# EAGLE schematic uart-usb (EAGLE 6.1)
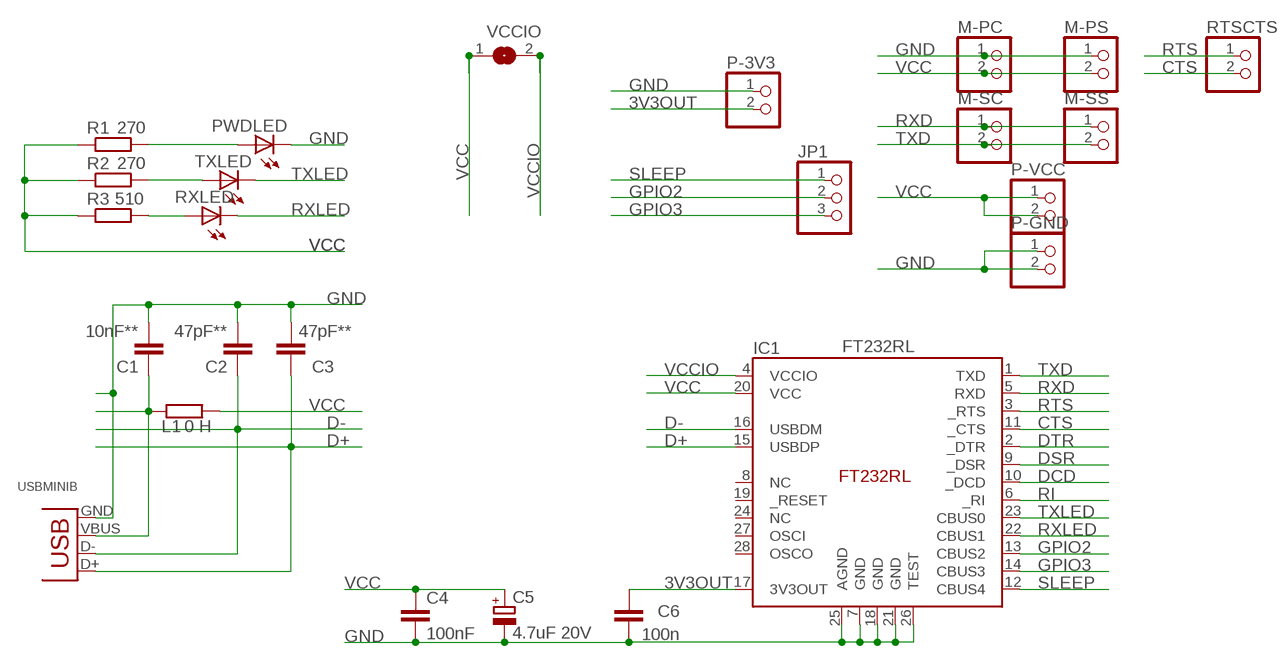
[diagram p0: schematic, sheet 1]

## Parts
C1  10nF**  C-EUC0805K  [C0805K]
C2  47pF**  C-EUC0805K  [C0805K]
C3  47pF**  C-EUC0805K  [C0805K]
C4  100nF  C-EUC0805K  [C0805K]
C5  4.7uF 20V  CPOL-EUSMCA  [SMC_A]
C6  100n  C-EUC0805K  [C0805K]
IC1  FT232RL  [SSOP-28]
JP1  PINHD-1X3  [1X03]
L1  0 H  R-EU_R0805  [R0805]
M-PC  PINHD-1X2/90  [1X02/90]
M-PS  PINHD-1X2  [1X02]
M-SC  PINHD-1X2/90  [1X02/90]
M-SS  PINHD-1X2  [1X02]
P-3V3  PINHD-1X2  [1X02]
P-GND  PINHD-1X2  [1X02]
P-VCC  PINHD-1X2  [1X02]
PWDLED  LEDCHIPLED_0805  [CHIPLED_0805]
R1  270  R-EU_R0805  [R0805]
R2  270  R-EU_R0805  [R0805]
R3  510  R-EU_R0805  [R0805]
RTSCTS  PINHD-1X2  [1X02]
RXLED  LEDCHIPLED_0805  [CHIPLED_0805]
TXLED  LEDCHIPLED_0805  [CHIPLED_0805]
USBMINIB  USB-MB-S  [USB-MB-S]
VCCIO  SJ  [SJ]

## Nets
3V3OUT [GPIO]: C6.1 IC1.17(3V3OUT) P-3V3.2
CTS [NORMAL]: IC1.11(_CTS) RTSCTS.2
D+: C3.1 IC1.15(USBDP) USBMINIB.D+
D-: C2.1 IC1.16(USBDM) USBMINIB.D-
DCD [NORMAL]: IC1.10(_DCD)
DSR [NORMAL]: IC1.9(_DSR)
DTR [NORMAL]: IC1.2(_DTR)
GND: C1.2 C2.2 C3.2 C4.2 C5.- C6.2 IC1.7(GND) IC1.18(GND) IC1.21(GND) IC1.25(AGND) IC1.26(TEST) M-PC.1 M-PS.1 P-3V3.1 P-GND.1 P-GND.2 PWDLED.C USBMINIB.GND
GPIO2 [GPIO]: IC1.13(CBUS2) JP1.2
GPIO3 [GPIO]: IC1.14(CBUS3) JP1.3
N$1: R3.2 RXLED.A
N$2: PWDLED.A R1.2
N$3: R2.2 TXLED.A
N$4: C1.1 L1.1 USBMINIB.VBUS
RI [NORMAL]: IC1.6(_RI)
RTS [NORMAL]: IC1.3(_RTS) RTSCTS.1
RXD [NORMAL]: IC1.5(RXD) M-SC.1 M-SS.1
RXLED [GPIO]: IC1.22(CBUS1) RXLED.C
SLEEP [GPIO]: IC1.12(CBUS4) JP1.1
TXD [NORMAL]: IC1.1(TXD) M-SC.2 M-SS.2
TXLED [GPIO]: IC1.23(CBUS0) TXLED.C
VCC: C4.1 C5.+ IC1.20(VCC) L1.2 M-PC.2 M-PS.2 P-VCC.1 P-VCC.2 R1.1 R2.1 R3.1 VCCIO.1
VCCIO: IC1.4(VCCIO) VCCIO.2
Unconnected: IC1.8(NC) IC1.19(_RESET) IC1.24(NC) IC1.27(OSCI) IC1.28(OSCO)

## Library data of the parts
C1-C4 C6 = resistor:C-EU: CAPACITOR, European symbol
C5 = resistor:CPOL-EU: POLARIZED CAPACITOR, European symbol
IC1 = ftdi4:FT232RL
JP1 = pinhead:PINHD-1X3: PIN HEADER
L1 R1-R3 = resistor:R-EU_: RESISTOR, European symbol
M-PC M-PS M-SC M-SS P-3V3 P-GND P-VCC RTSCTS = pinhead:PINHD-1X2: PIN HEADER
PWDLED RXLED TXLED = led:LED: LED OSRAM: - CHIPLED LG R971, LG N971, LY N971, LG Q971, LY Q971, LO R971, LY R971 LH N974, LH R974 LS Q976, LO Q976, LY Q976 LO Q996 - Hyper CHIPLED LW Q18S LB Q993, LB Q99A, LB R99A - SideLED LS A670, LO A670, LY A670, LG A670, LP A670 LB A673, LV A673, LT A673, LW A673 LH A674 LY A675 LS A676, LA A676, LO A676, LY A676, LW A676 LS A679, LY A679, LG A679 - Hyper Micro SIDELED® LS Y876, LA Y876, LO Y876, LY Y876 LT Y87S - SmartLED LW L88C, LW L88S LB L89C, LB L89S, LG L890 LS L89K, LO L89K, LY L89K LS L896, LA L896, LO L896, LY L896 - TOPLED LS T670, LO T670, LY T670, LG T670, LP T670 LSG T670, LSP T670, LSY T670, LOP T670, LYG T670 LG T671, LOG T671, LSG T671 LB T673, LV T673, LT T673, LW T673 LH T674 LS T676, LA T676, LO T676, LY T676, LB T676, LH T676, LSB T676, LW T676 LB T67C, LV T67C, LT T67C, LS T67K, LO T67K, LY T67K, LW E67C LS E67B, LA E67B, LO E67B, LY E67B, LB E67C, LV E67C, LT E67C LW T67C LS T679, LY T679, LG T679 LS T770, LO T770, LY T770, LG T770, LP T770 LB T773, LV T773, LT T773, LW T773 LH T774 LS E675, LA E675, LY E675, LS T675 LS T776, LA T776, LO T776, LY T776, LB T776 LHGB T686 LT T68C, LB T68C - Hyper Mini TOPLED® LB M676 - Mini TOPLED Santana® LG M470 LS M47K, LO M47K, LY M47K Source: http://www.osram.convergy.de LUXEON: - LUMILED® LXK2-PW12-R00, LXK2-PW12-S00, LXK2-PW14-U00, LXK2-PW14-V00 LXK2-PM12-R00, LXK2-PM12-S00, LXK2-PM14-U00 LXK2-PE12-Q00, LXK2-PE12-R00, LXK2-PE12-S00, LXK2-PE14-T00, LXK2-PE14-U00 LXK2-PB12-K00, LXK2-PB12-L00, LXK2-PB12-M00, LXK2-PB14-N00, LXK2-PB14-P00, LXK2-PB14-Q00 LXK2-PR12-L00, LXK2-PR12-M00, LXK2-PR14-Q00, LXK2-PR14-R00 LXK2-PD12-Q00, LXK2-PD12-R00, LXK2-PD12-S00 LXK2-PH12-R00, LXK2-PH12-S00 LXK2-PL12-P00, LXK2-PL12-Q00, LXK2-PL12-R00 Source: www.luxeon.com KINGBRIGHT: KA-3528ASYC Source: www.kingbright.com
USBMINIB = con-usb-3:USB: USB Connectors
VCCIO = jumper:SJ: SMD solder JUMPER

## Net classes
0 POWER: width 0.356 mm
1 GPIO: width 0.356 mm
2 NORMAL: width 0.356 mm